# Altium project LimeSDR-Micro_M.2_1v0.PrjPcb (part 4 of 10)

## Sheet 07_LMS7002M_Power.SchDoc: LMS7002M power
size A3; Organization: Lime Microsystems; Address1: Surrey Tech Centre; Address2: Guildford GU2 7YG; Address3: Surrey; Address4: United Kingdom; Revision: v1.0; SheetNumber: 7; SheetTotal: 11
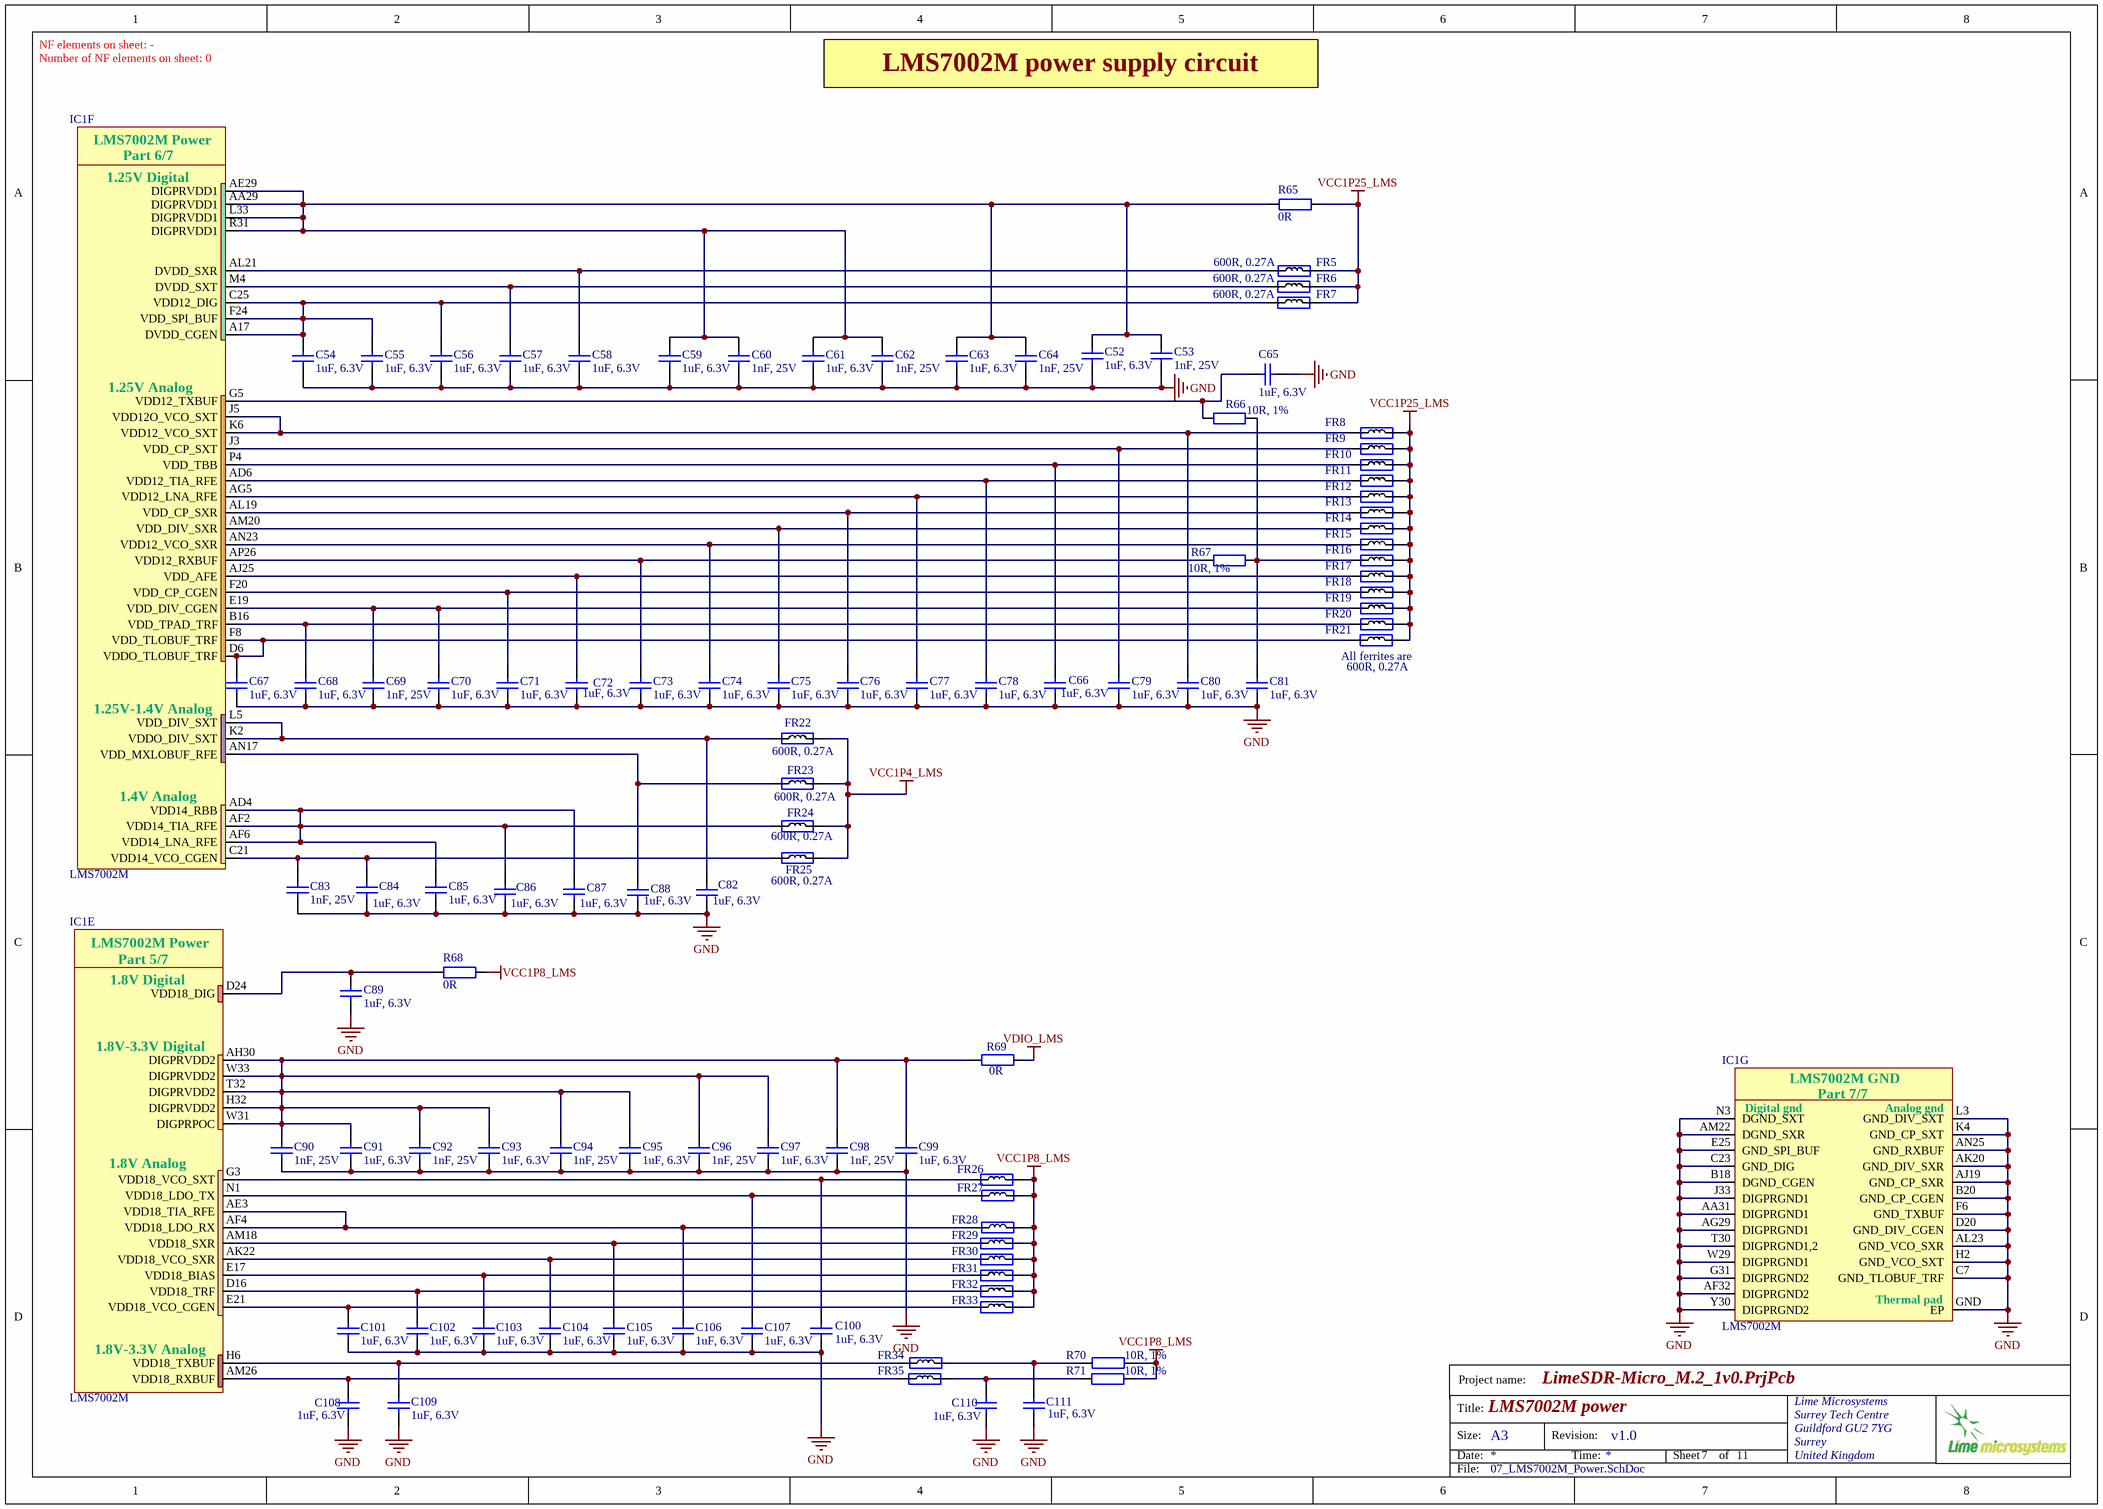
[diagram p6: 07_LMS7002M_Power.SchDoc]

### Parts
(Parts that share a designator on the sheet are numbered #1, #2 ... from top to bottom, then left to right.)
C52  1uF, 6.3V  [CAP0201]
C53  1nF, 25V  [CAP0201]
C54  1uF, 6.3V  [CAP0201]
C55  1uF, 6.3V  [CAP0201]
C56  1uF, 6.3V  [CAP0201]
C57  1uF, 6.3V  [CAP0201]
C58  1uF, 6.3V  [CAP0201]
C59  1uF, 6.3V  [CAP0201]
C60  1nF, 25V  [CAP0201]
C61  1uF, 6.3V  [CAP0201]
C62  1nF, 25V  [CAP0201]
C63  1uF, 6.3V  [CAP0201]
C64  1nF, 25V  [CAP0201]
C65  1uF, 6.3V  [CAP0201]
C66  1uF, 6.3V  [CAP0201]
C67  1uF, 6.3V  [CAP0201]
C68  1uF, 6.3V  [CAP0201]
C69  1nF, 25V  [CAP0201]
C70  1uF, 6.3V  [CAP0201]
C71  1uF, 6.3V  [CAP0201]
C72  1uF, 6.3V  [CAP0201]
C73  1uF, 6.3V  [CAP0201]
C74  1uF, 6.3V  [CAP0201]
C75  1uF, 6.3V  [CAP0201]
C76  1uF, 6.3V  [CAP0201]
C77  1uF, 6.3V  [CAP0201]
C78  1uF, 6.3V  [CAP0201]
C79  1uF, 6.3V  [CAP0201]
C80  1uF, 6.3V  [CAP0201]
C81  1uF, 6.3V  [CAP0201]
C82  1uF, 6.3V  [CAP0201]
C83  1nF, 25V  [CAP0201]
C84  1uF, 6.3V  [CAP0201]
C85  1uF, 6.3V  [CAP0201]
C86  1uF, 6.3V  [CAP0201]
C87  1uF, 6.3V  [CAP0201]
C88  1uF, 6.3V  [CAP0201]
C89  1uF, 6.3V  [CAP0201]
C90  1nF, 25V  [CAP0201]
C91  1uF, 6.3V  [CAP0201]
C92  1nF, 25V  [CAP0201]
C93  1uF, 6.3V  [CAP0201]
C94  1nF, 25V  [CAP0201]
C95  1uF, 6.3V  [CAP0201]
C96  1nF, 25V  [CAP0201]
C97  1uF, 6.3V  [CAP0201]
C98  1nF, 25V  [CAP0201]
C99  1uF, 6.3V  [CAP0201]
C100  1uF, 6.3V  [CAP0201]
C101  1uF, 6.3V  [CAP0201]
C102  1uF, 6.3V  [CAP0201]
C103  1uF, 6.3V  [CAP0201]
C104  1uF, 6.3V  [CAP0201]
C105  1uF, 6.3V  [CAP0201]
C106  1uF, 6.3V  [CAP0201]
C107  1uF, 6.3V  [CAP0201]
C108  1uF, 6.3V  [CAP0201]
C109  1uF, 6.3V  [CAP0201]
C110  1uF, 6.3V  [CAP0201]
C111  1uF, 6.3V  [CAP0201]
FR5#1  600R, 0.27A  [RES0201]
FR6#1  600R, 0.27A  [RES0201]
FR7  600R, 0.27A  [RES0201]
FR8  600R, 0.27A  [RES0201]
FR9  600R, 0.27A  [RES0201]  (value not drawn)
FR10  600R, 0.27A  [RES0201]  (value not drawn)
FR11  600R, 0.27A  [RES0201]  (value not drawn)
FR12  600R, 0.27A  [RES0201]  (value not drawn)
FR13  600R, 0.27A  [RES0201]  (value not drawn)
FR14  600R, 0.27A  [RES0201]  (value not drawn)
FR15  600R, 0.27A  [RES0201]  (value not drawn)
FR16  600R, 0.27A  [RES0201]  (value not drawn)
FR17  600R, 0.27A  [RES0201]  (value not drawn)
FR18  600R, 0.27A  [RES0201]  (value not drawn)
FR19  600R, 0.27A  [RES0201]  (value not drawn)
FR20  600R, 0.27A  [RES0201]  (value not drawn)
FR21  600R, 0.27A  [RES0201]  (value not drawn)
FR22  600R, 0.27A  [RES0201]
FR23  600R, 0.27A  [RES0201]
FR24  600R, 0.27A  [RES0201]
FR25  600R, 0.27A  [RES0201]
FR26  600R, 0.27A  [RES0201]  (value not drawn)
FR27  600R, 0.27A  [RES0201]  (value not drawn)
FR28  600R, 0.27A  [RES0201]  (value not drawn)
FR29  600R, 0.27A  [RES0201]  (value not drawn)
FR30  600R, 0.27A  [RES0201]  (value not drawn)
FR31  600R, 0.27A  [RES0201]  (value not drawn)
FR32  600R, 0.27A  [RES0201]  (value not drawn)
FR33  600R, 0.27A  [RES0201]  (value not drawn)
FR34  600R, 0.27A  [RES0201]  (value not drawn)
FR35  600R, 0.27A  [RES0201]  (value not drawn)
IC1  LMS7002M  [LMS7002M_v5_LESS_SILK]  (parts E,F,G of 7)
R65  0R  [RES0402]
R66  10R, 1%  [RES0201]
R67  10R, 1%  [RES0201]
R68  0R  [RES0201]
R69  0R  [RES0402]
R70  10R, 1%  [RES0201]
R71  10R, 1%  [RES0201]

### Nets
GND: C52.2 C53.2 C54.2 C55.2 C56.2 C57.1 C58.2 C59.2 C60.2 C61.2 C62.2 C63.2 C64.2 C65.2 C66.2 C67.2 C68.2 C69.2 C70.2 C71.1 C72.2 C73.2 C74.2 C75.2 C76.2 C77.2 C78.1 C79.2 C80.1 C81.1 C82.2 C83.2 C84.2 C85.2 C86.2 C87.2 C88.2 C89.2 C90.2 C91.2 C92.2 C93.2 C94.2 C95.2 C96.2 C97.2 C98.2 C99.2 C100.2 C101.2 C102.2 C103.2 C104.2 C105.2 C106.2 C107.2 C108.2 C109.2 C110.2 C111.2 IC1.AA31(DIGPRGND1) IC1.AF32(DIGPRGND2) IC1.AG29(DIGPRGND1) IC1.AJ19(GND_CP_SXR) IC1.AK20(GND_DIV_SXR) IC1.AL23(GND_VCO_SXR) IC1.AM22(DGND_SXR) IC1.AN25(GND_RXBUF) IC1.B18(DGND_CGEN) IC1.B20(GND_CP_CGEN) IC1.C7(GND_TLOBUF_TRF) IC1.C23(GND_DIG) IC1.D20(GND_DIV_CGEN) IC1.E25(GND_SPI_BUF) IC1.F6(GND_TXBUF) IC1.G31(DIGPRGND2) IC1.GND(EP) IC1.H2(GND_VCO_SXT) IC1.J33(DIGPRGND1) IC1.K4(GND_CP_SXT) IC1.L3(GND_DIV_SXT) IC1.N3(DGND_SXT) IC1.T30(DIGPRGND1,2) IC1.W29(DIGPRGND1) IC1.Y30(DIGPRGND2)
VCC1P4_LMS: FR22.2 FR23.2 FR24.2 FR25.2
VCC1P8_LMS: FR26.2 FR27.1 FR28.1 FR29.2 FR30.2 FR31.2 FR32.2 FR33.2 R68.2 R70.2 R71.1
VCC1P25_LMS: FR5#1.2 FR6#1.2 FR7.2 FR8.2 FR9.2 FR10.2 FR11.2 FR12.2 FR13.2 FR14.2 FR15.2 FR16.2 FR17.2 FR18.2 FR19.2 FR20.2 FR21.2 R65.1
VDIO_LMS: R69.1
NetC52_1: C52.1 C53.1 C59.1 C60.1 C61.1 C62.1 C63.1 C64.1 IC1.AA29(DIGPRVDD1) IC1.AE29(DIGPRVDD1) IC1.L33(DIGPRVDD1) IC1.R31(DIGPRVDD1) R65.2
NetC54_1: C54.1 C55.1 C56.1 FR7.1 IC1.A17(DVDD_CGEN) IC1.C25(VDD12_DIG) IC1.F24(VDD_SPI_BUF)
NetC57_2: C57.2 FR6#1.1 IC1.M4(DVDD_SXT)
NetC58_1: C58.1 FR5#1.1 IC1.AL21(DVDD_SXR)
NetC65_1: C65.1 IC1.G5(VDD12_TXBUF) R66.1
NetC66_1: C66.1 FR10.1 IC1.P4(VDD_TBB)
NetC67_1: C67.1 FR21.1 IC1.D6(VDDO_TLOBUF_TRF) IC1.F8(VDD_TLOBUF_TRF)
NetC68_1: C68.1 FR20.1 IC1.B16(VDD_TPAD_TRF)
NetC69_1: C69.1 C70.1 FR19.1 IC1.E19(VDD_DIV_CGEN)
NetC71_2: C71.2 FR18.1 IC1.F20(VDD_CP_CGEN)
NetC72_1: C72.1 FR17.1 IC1.AJ25(VDD_AFE)
NetC73_1: C73.1 IC1.AP26(VDD12_RXBUF) R67.1
NetC74_1: C74.1 FR15.1 IC1.AN23(VDD12_VCO_SXR)
NetC75_1: C75.1 FR14.1 IC1.AM20(VDD_DIV_SXR)
NetC76_1: C76.1 FR13.1 IC1.AL19(VDD_CP_SXR)
NetC77_1: C77.1 FR12.1 IC1.AG5(VDD12_LNA_RFE)
NetC78_2: C78.2 FR11.1 IC1.AD6(VDD12_TIA_RFE)
NetC79_1: C79.1 FR9.1 IC1.J3(VDD_CP_SXT)
NetC80_2: C80.2 FR8.1 IC1.J5(VDD12O_VCO_SXT) IC1.K6(VDD12_VCO_SXT)
NetC81_2: C81.2 FR16.1 R66.2 R67.2
NetC82_1: C82.1 FR22.1 IC1.K2(VDDO_DIV_SXT) IC1.L5(VDD_DIV_SXT)
NetC83_1: C83.1 C84.1 FR25.1 IC1.C21(VDD14_VCO_CGEN)
NetC85_1: C85.1 C86.1 C87.1 FR24.1 IC1.AD4(VDD14_RBB) IC1.AF2(VDD14_TIA_RFE) IC1.AF6(VDD14_LNA_RFE)
NetC88_1: C88.1 FR23.1 IC1.AN17(VDD_MXLOBUF_RFE)
NetC89_1: C89.1 IC1.D24(VDD18_DIG) R68.1
NetC90_1: C90.1 C91.1 C92.1 C93.1 C94.1 C95.1 C96.1 C97.1 C98.1 C99.1 IC1.AH30(DIGPRVDD2) IC1.H32(DIGPRVDD2) IC1.T32(DIGPRVDD2) IC1.W31(DIGPRPOC) IC1.W33(DIGPRVDD2) R69.2
NetC100_1: C100.1 FR26.1 IC1.G3(VDD18_VCO_SXT)
NetC101_1: C101.1 FR33.1 IC1.E21(VDD18_VCO_CGEN)
NetC102_1: C102.1 FR32.1 IC1.D16(VDD18_TRF)
NetC103_1: C103.1 FR31.1 IC1.E17(VDD18_BIAS)
NetC104_1: C104.1 FR30.1 IC1.AK22(VDD18_VCO_SXR)
NetC105_1: C105.1 FR29.1 IC1.AM18(VDD18_SXR)
NetC106_1: C106.1 FR28.2 IC1.AE3(VDD18_TIA_RFE) IC1.AF4(VDD18_LDO_RX)
NetC107_1: C107.1 FR27.2 IC1.N1(VDD18_LDO_TX)
NetC108_1: C108.1 FR35.1 IC1.AM26(VDD18_RXBUF)
NetC109_1: C109.1 FR34.2 IC1.H6(VDD18_TXBUF)
NetC110_1: C110.1 FR35.2 R71.2
NetC111_1: C111.1 FR34.1 R70.1

### Notes on the sheet
- NF elements on sheet: -
- Number of NF elements on sheet: 0
- LMS7002M power supply circuit
- (near FR21) All ferrites are
- Project name:
- Title:
- Size:
- Date:
- A3
- Revision:
- Time:
- Sheet
- of
- File:
- (in symbol LMS7002Mr4, part E) LMS7002M Power; Part 5/7; 1.8V Digital; 1.8V-3.3V Digital; 1.8V Analog; 1.8V-3.3V Analog
- (in symbol LMS7002Mr4, part F) LMS7002M Power; Part 6/7; 1.25V Digital; 1.25V Analog; 1.25V-1.4V Analog; 1.4V Analog
- (in symbol LMS7002Mr4, part G) LMS7002M GND; Part 7/7; Digital gnd; Analog gnd; Thermal pad

### Library data of the parts
C52 C54-C59 C61 C63 C65-C68 C70-C82 C84-C89 C91 C93 C95 C97 C99-C111 = Cap_0402: Manufacturer: TDK Corporation; Manufacturer Part Number 1: JMK063ABJ105MP-F; Part Description: 1µF ±20% 6.3V X5R Ceramic Capacitor -55°C ~ 85°C Surface Mount, MLCC 0201 (0603 Metric) 0.024" L x 0.012" W (0.60mm x 0.30mm); Value: 1uF, 20%; Tolerance: ±20%; Capacitance: 1.0µF; Temperature Coefficient: X5R; Supplier 1: Digi-Key; Supplier Part Number 1: 587-5864-2-ND; Applications: General Purpose; Features: -; Lead Style: -; Ratings: -; Thickness (Max): -; Lead Spacing: -; Height - Seated (Max): -; Size / Dimension: 0.024" L x 0.012" W (0.60mm x 0.30mm); Mounting Type: Surface Mount, MLCC; Operating Temperature: -55°C ~ 85°C; Package / Case: 0201 (0603 Metric); Packaging: Cut Tape (CT); Voltage - Rated: 6.3V; Category: Capacitors; RoHS: RoHS Compliant
C53 C60 C62 C64 C69 C83 C90 C92 C94 C96 C98 = Cap_0402: Manufacturer Part Number 1: C0603X7R1E102K030BA; Manufacturer: TDK Corporation; Part Description: 1000pF ±10% 25V X7R Ceramic Capacitor -55°C ~ 125°C Surface Mount, MLCC 0201 (0603 Metric) 0.024" L x 0.012" W (0.60mm x 0.30mm); Temperature Coefficient: X7R; Tolerance: ±10%; Capacitance: 1000pF; Value: 1nF, 25V; Supplier 1: Digi-Key; Supplier Part Number 1: 445-7275-1-ND; Voltage - Rated: 25V; Features: -; Package / Case: 0201 (0603 Metric); Lead Spacing: -; Mounting Type: Surface Mount, MLCC; Lead Style: -; Height - Seated (Max): -; Operating Temperature: -55°C ~ 125°C; Size / Dimension: 0.024" L x 0.012" W (0.60mm x 0.30mm); Applications: General Purpose; Ratings: -; Thickness (Max): 0.013" (0.33mm); RoHS: RoHS Compliant; Packaging: Cut Tape (CT); Category: Capacitors
FR5#1 FR6#1 FR7-FR35 = Ferrite: Manufacturer Part Number 1: BK0603TS601-T; Manufacturer: Taiyo Yuden; Part Description: FERRITE BEAD 600 OHM 0201 1LN; DC Resistance (DCR): 750 mOhm Max; Filter Type: Differential Mode - Single; Impedance @ Frequency: 600 Ohm @ 100MHz; Current Rating: 270mA; Value: 600R@100MHz; Supplier 1: Digi-Key; Supplier Part Number 1: 587-3277-1-ND; Size / Dimension: 0.024" L x 0.012" W (0.60mm x 0.30mm); Package / Case: 0201 (0603 Metric); Height (Max): 0.013" (0.33mm); Mounting Type: Surface Mount; Packaging: Cut Tape (CT); RoHS: RoHS Compliant; Category: Filters
IC1 = LMS7002Mr4: Schematic symbol revision 4. Default footprint - 0.31mm pad; Manufacturer: Lime Microsystems; Part Description: IC FPRF Transceiver LMS7002M; 261 pin aQFN; Supplier 1: Lime Microsystems; Supplier Part Number 1: LMS7002M; Manufacturer Part Number 1: LMS7002M
R65 R69 = Res_0402: Manufacturer Part Number 1: RC0402JR-070RL; Manufacturer: Yageo; Part Description: RES SMD 0.0OHM JUMPER 1/16W 0402; Resistance (Ohms): 0.0; Tolerance: Jumper; Power (Watts): 0.063W, 1/16W; Value: 0R; Supplier 1: Digi-Key; Supplier Part Number 1: 311-0.0JRTR-ND; Category: Resistors; Temperature Coefficient: -; Features: Moisture Resistant; Supplier Device Package: 0402; Height: 0.016" (0.40mm); Package / Case: 0402 (1005 Metric); Operating Temperature: -55°C ~ 155°C; Size / Dimension: 0.039" L x 0.020" W (1.00mm x 0.50mm); Composition: Thick Film; Packaging: Tape & Reel (TR); Number of Terminations: 2; RoHS: RoHS Compliant
R66 R67 R70 R71 = Res_0402: Manufacturer: Panasonic Electronic Components; Part Description: RES SMD 10 OHM 1% 1/20W 0201; Manufacturer Part Number 1: ERJ-1GEF10R0C; Power (Watts): 0.05W, 1/20W; Resistance (Ohms): 10; Temperature Coefficient: ±200ppm/°C; Value: 10R, 1%; Supplier 1: Digi-Key; Supplier Part Number 1: P10.0ABCT-ND; Package / Case: 0201 (0603 Metric); Height: 0.010" (0.26mm); Supplier Device Package: 0201; Packaging: Cut Tape (CT); Composition: Thick Film; Category: Resistors; Tolerance: ±1%; Number of Terminations: 2; Size / Dimension: 0.024" L x 0.012" W (0.60mm x 0.30mm); Operating Temperature: -55°C ~ 125°C; Features: -; RoHS: RoHS Compliant
R68 = Res_0402: Manufacturer: Yageo; Part Description: 0 Ohms Jumper Chip Resistor 0201 (0603 Metric) Moisture Resistant Thick Film; Manufacturer Part Number 1: RC0201JR-070RL; Tolerance: 5%; Max Power Dissipation: 50mW; Voltage Rating (DC): 25V; Value: 0R; Supplier 1: Digi-Key; Supplier Part Number 1: 311-0.0NCT-ND; Number of Terminations: 2; Height: 0.01inch; Features: Moisture Resistant; RoHS: Yes; Packaging: Tape and Reel; Case/Package: 0201; Case Code (Imperial): 0201; Case Code (Metric): 0603; ComponentLink1Description: http://www.yageo.com/documents/recent/PYu-RC_Group_51_RoHS_L_7.pdf; ComponentLink1URL: http://www.yageo.com/documents/recent/PYu-RC_Group_51_RoHS_L_7.pdf; ComponentLink2Description: https://datasheet.ciiva.com/7672/1563626-7672248.pdf?src-supplier=Element14; ComponentLink2URL: https://datasheet.ciiva.com/7672/1563626-7672248.pdf?src-supplier=Element14; ComponentLink3Description: https://datasheet.ciiva.com/7672/1563626-7672247.pdf?src-supplier=Element14; ComponentLink3URL: https://datasheet.ciiva.com/7672/1563626-7672247.pdf?src-supplier=Element14; ComponentLink4Description: https://datasheet.ciiva.com/7660/1421516-7660808.pdf?src-supplier=Element14; ComponentLink4URL: https://datasheet.ciiva.com/7660/1421516-7660808.pdf?src-supplier=Element14; ComponentLink5Description: https://datasheet.ciiva.com/46391/1421516-46391340.pdf?src-supplier=Element14; ComponentLink5URL: https://datasheet.ciiva.com/46391/1421516-46391340.pdf?src-supplier=Element14; Construction: Rectangular; Contact Plating: Tin,Matte; Depth: 0.3mm; Lead Free: Lead Free; Length: 0.024inch; Max Operating Temperature: 125°C; Military Standard: Not; Min Operating Temperature: -55°C; Package Quantity: 1; Power Rating: 50mW; Pricing 1: 1=0,10000, 10=0,03700, 25=0,02680, 50=0,02020, 100=0,01500, 250=0,01140, 500=0,00912, 1000=0,00672, 5000=0,00482 (USD); Radiation Hardening: No; Resistance: 0R; Resistance Tolerance: 5%; Resistor Type: Thick Film; RoHS Compliant: Yes; Series: RC; Size Code: 0201; Stock 1: 6252381; Termination: SMD/SMT; Voltage Rating: 25V; Weight: 6E-06oz; Width: 0.012inch

## Sheet 08_BB_Processor.SchDoc: BB Processor
size A3; Organization: Lime Microsystems; Address1: Surrey Tech Centre; Address2: Guildford GU2 7YG; Address3: Surrey; Address4: United Kingdom; Revision: v1.0; SheetNumber: 8; SheetTotal: 11
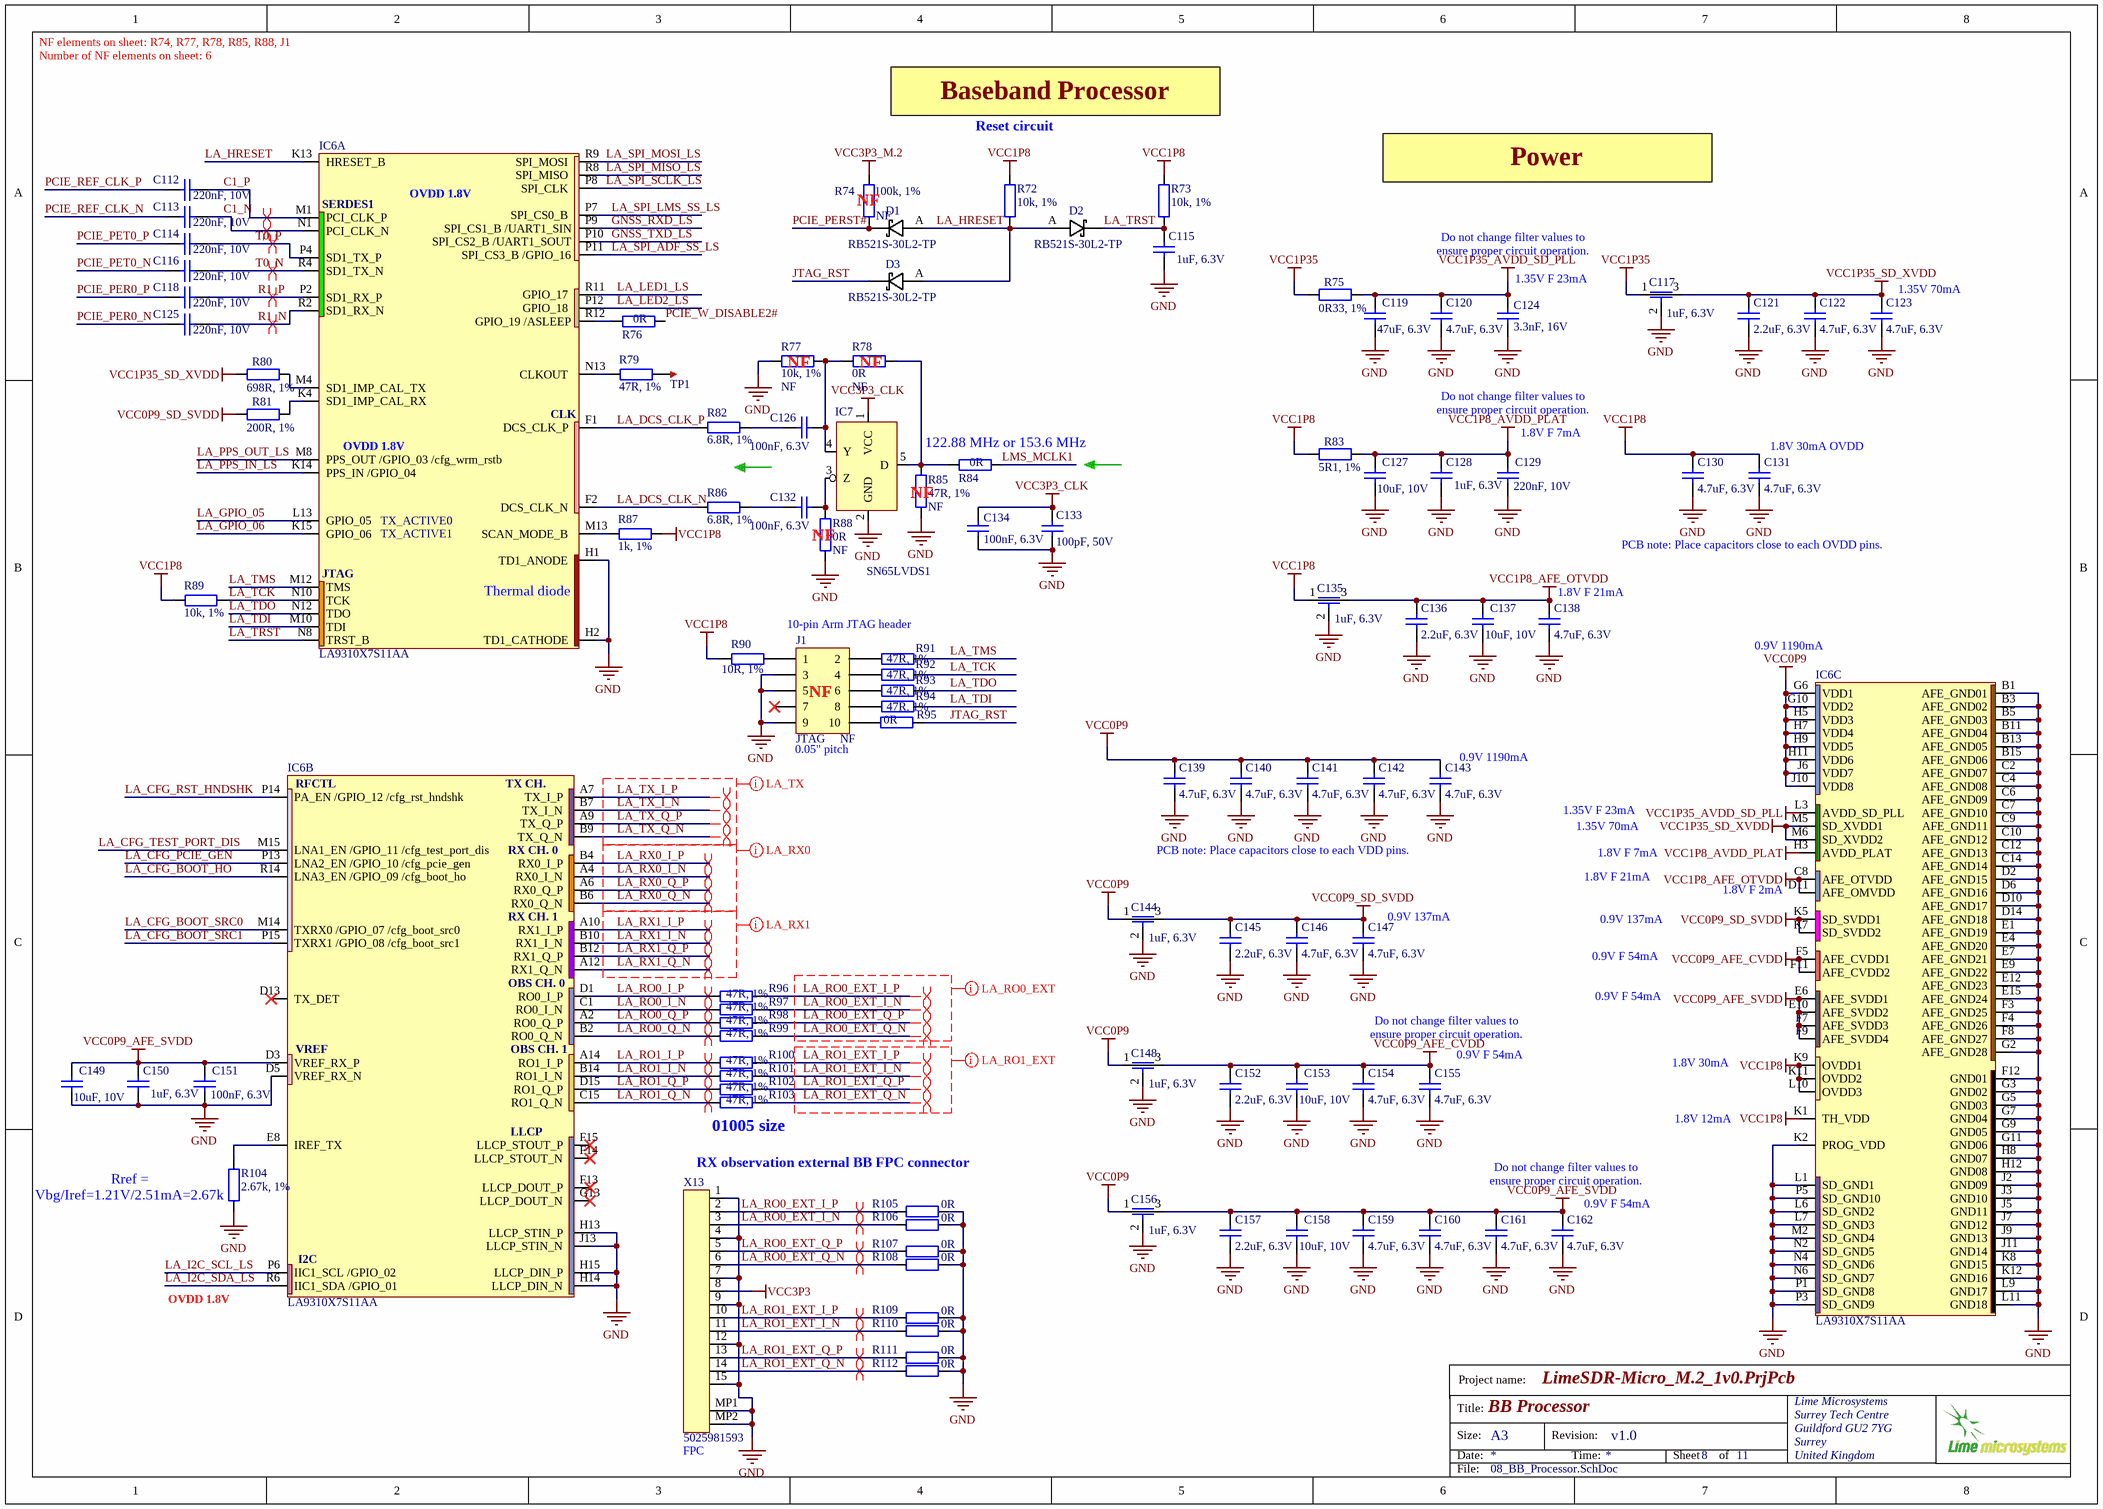
[diagram p7: 08_BB_Processor.SchDoc]

### Parts
(Parts that share a designator on the sheet are numbered #1, #2 ... from top to bottom, then left to right.)
C112#1  220nF, 10V  [CAP0201]
C113#1  220nF, 10V  [CAP0201]
C114#1  220nF, 10V  [CAP0201]
C115  1uF, 6.3V  [CAP0201]
C116  220nF, 10V  [CAP0201]
C117#1  1uF, 6.3V  [CAP0603_FEEDTHROUGH]
C118#1  220nF, 10V  [CAP0201]
C119#1  47uF, 6.3V  [CAP0603]
C120#1  4.7uF, 6.3V  [CAP0201]
C121  2.2uF, 6.3V  [CAP0201]
C122  4.7uF, 6.3V  [CAP0201]
C123  4.7uF, 6.3V  [CAP0201]
C124#1  3.3nF, 16V  [CAP0201]
C125#1  220nF, 10V  [CAP0201]
C126#1  100nF, 6.3V  [CAP0201]
C127#1  10uF, 10V  [CAP0402]
C128  1uF, 6.3V  [CAP0201]
C129  220nF, 10V  [CAP0201]
C130  4.7uF, 6.3V  [CAP0201]
C131  4.7uF, 6.3V  [CAP0201]
C132  100nF, 6.3V  [CAP0201]
C133  100pF, 50V  [CAP0201]
C134  100nF, 6.3V  [CAP0201]
C135  1uF, 6.3V  [CAP0603_FEEDTHROUGH]
C136  2.2uF, 6.3V  [CAP0201]
C137  10uF, 10V  [CAP0402]
C138  4.7uF, 6.3V  [CAP0201]
C139  4.7uF, 6.3V  [CAP0201]
C140  4.7uF, 6.3V  [CAP0201]
C141  4.7uF, 6.3V  [CAP0201]
C142  4.7uF, 6.3V  [CAP0201]
C143  4.7uF, 6.3V  [CAP0201]
C144  1uF, 6.3V  [CAP0603_FEEDTHROUGH]
C145  2.2uF, 6.3V  [CAP0201]
C146  4.7uF, 6.3V  [CAP0201]
C147  4.7uF, 6.3V  [CAP0201]
C148  1uF, 6.3V  [CAP0603_FEEDTHROUGH]
C149  10uF, 10V  [CAP0402]
C150  1uF, 6.3V  [CAP0201]
C151  100nF, 6.3V  [CAP0201]
C152  2.2uF, 6.3V  [CAP0201]
C153  10uF, 10V  [CAP0402]
C154  4.7uF, 6.3V  [CAP0201]
C155  4.7uF, 6.3V  [CAP0201]
C156  1uF, 6.3V  [CAP0603_FEEDTHROUGH]
C157  2.2uF, 6.3V  [CAP0201]
C158  10uF, 10V  [CAP0402]
C159  4.7uF, 6.3V  [CAP0201]
C160  4.7uF, 6.3V  [CAP0201]
C161  4.7uF, 6.3V  [CAP0201]
C162  4.7uF, 6.3V  [CAP0201]
D1  RB521S-30L2-TP  [RB521S-30L2-TP_DFN1006]
D2  RB521S-30L2-TP  [RB521S-30L2-TP_DFN1006]
D3  RB521S-30L2-TP  [RB521S-30L2-TP_DFN1006]
IC6  LA9310X7S11AA  [LA9310X7S11AA]  (parts A,B,C of 3)
IC7  SN65LVDS1  [SOT23-5_NO_SILK]
J1  JTAG  Assembly Info: NF  [HEADER_5x2_TH_HALF_PITCH]
R72  10k, 1%  [RES0201]
R73  10k, 1%  [RES0201]
R74  100k, 1%  Assembly Info: NF  [RES0201]
R75  0R33, 1%  [RES0201]
R76  0R  [RES0201]
R77  10k, 1%  Assembly Info: NF  [RES0201]
R78  0R  Assembly Info: NF  [RES0201]
R79  47R, 1%  [RES0201]
R80  698R, 1%  [RES0201]
R81  200R, 1%  [RES0201]
R82  6.8R, 1%  [RES0201]
R83  5R1, 1%  [RES0201]
R84  0R  [RES0201]
R85  47R, 1%  Assembly Info: NF  [RES0201]
R86  6.8R, 1%  [RES0201]
R87  1k, 1%  [RES0201]
R88  0R  Assembly Info: NF  [RES0201]
R89  10k, 1%  [RES0201]
R90  10R, 1%  [RES0201]
R91  47R, 1%  [RES0201]
R92  47R, 1%  [RES0201]
R93  47R, 1%  [RES0201]
R94  47R, 1%  [RES0201]
R95  0R  [RES0201]
R96  47R, 1%  [RES01005]
R97  47R, 1%  [RES01005]
R98  47R, 1%  [RES01005]
R99  47R, 1%  [RES01005]
R100  47R, 1%  [RES01005]
R101  47R, 1%  [RES01005]
R102  47R, 1%  [RES01005]
R103  47R, 1%  [RES01005]
R104  2.67k, 1%  [RES0201]
R105  0R  [RES01005]
R106  0R  [RES01005]
R107  0R  [RES01005]
R108  0R  [RES01005]
R109  0R  [RES01005]
R110  0R  [RES01005]
R111  0R  [RES01005]
R112  0R  [RES01005]
TP1  TESTPOINT_PAD  [TP_PAD_1MM]  (value not drawn)  (no BOM)
X13  5025981593  [5025981593_FPC_connector]

### Nets
GND: C115.2 C117#1.2 C119#1.1 C120#1.1 C121.1 C122.1 C123.1 C124#1.2 C127#1.1 C128.2 C129.2 C130.1 C131.1 C133.1 C134.2 C135.2 C136.1 C137.1 C138.1 C139.1 C140.1 C141.1 C142.1 C143.1 C144.2 C145.1 C146.1 C147.1 C148.2 C149.1 C150.2 C151.2 C152.1 C153.1 C154.1 C155.1 C156.2 C157.1 C158.1 C159.1 C160.1 C161.1 C162.1 IC6.B1(AFE_GND01) IC6.B3(AFE_GND02) IC6.B5(AFE_GND03) IC6.B11(AFE_GND04) IC6.B13(AFE_GND05) IC6.B15(AFE_GND06) IC6.C2(AFE_GND07) IC6.C4(AFE_GND08) IC6.C6(AFE_GND09) IC6.C7(AFE_GND10) IC6.C9(AFE_GND11) IC6.C10(AFE_GND12) IC6.C12(AFE_GND13) IC6.C14(AFE_GND14) IC6.D2(AFE_GND15) IC6.D5(VREF_RX_N) IC6.D6(AFE_GND16) IC6.D10(AFE_GND17) IC6.D14(AFE_GND18) IC6.E1(AFE_GND19) IC6.E4(AFE_GND20) IC6.E7(AFE_GND21) IC6.E9(AFE_GND22) IC6.E12(AFE_GND23) IC6.E15(AFE_GND24) IC6.F3(AFE_GND25) IC6.F4(AFE_GND26) IC6.F8(AFE_GND27) IC6.F12(GND01) IC6.G2(AFE_GND28) IC6.G3(GND02) IC6.G5(GND03) IC6.G7(GND04) IC6.G9(GND05) IC6.G11(GND06) IC6.H1(TD1_ANODE) IC6.H2(TD1_CATHODE) IC6.H8(GND07) IC6.H12(GND08) IC6.H13(LLCP_STIN_P) IC6.H14(LLCP_DIN_N) IC6.H15(LLCP_DIN_P) IC6.J2(GND09) IC6.J3(GND10) IC6.J5(GND11) IC6.J7(GND12) IC6.J9(GND13) IC6.J11(GND14) IC6.J13(LLCP_STIN_N) IC6.K2(PROG_VDD) IC6.K8(GND15) IC6.K12(GND16) IC6.L1(SD_GND1) IC6.L6(SD_GND2) IC6.L7(SD_GND3) IC6.L9(GND17) IC6.L11(GND18) IC6.M2(SD_GND4) IC6.N2(SD_GND5) IC6.N4(SD_GND6) IC6.N6(SD_GND7) IC6.P1(SD_GND8) IC6.P3(SD_GND9) IC6.P5(SD_GND10) IC7.2(GND) J1.3 J1.5 J1.9 R77.1 R85.2 R88.1 R104.2 R105.2 R106.2 R107.2 R108.2 R109.2 R110.2 R111.2 R112.2 X13.1 X13.4 X13.7 X13.9 X13.12 X13.15 X13.MP1 X13.MP2
VCC0P9: C139.2 C140.2 C141.2 C142.2 C143.2 C144.1 C148.1 C156.1 IC6.G6(VDD1) IC6.G10(VDD2) IC6.H5(VDD3) IC6.H7(VDD4) IC6.H9(VDD5) IC6.H11(VDD6) IC6.J6(VDD7) IC6.J10(VDD8)
VCC0P9_AFE_CVDD: C148.3 C152.2 C153.2 C154.2 C155.2 IC6.F5(AFE_CVDD1) IC6.F11(AFE_CVDD2)
VCC0P9_AFE_SVDD: C149.2 C150.1 C151.1 C156.3 C157.2 C158.2 C159.2 C160.2 C161.2 C162.2 IC6.D3(VREF_RX_P) IC6.E6(AFE_SVDD1) IC6.E10(AFE_SVDD2) IC6.F7(AFE_SVDD3) IC6.F9(AFE_SVDD4)
VCC0P9_SD_SVDD: C144.3 C145.2 C146.2 C147.2 IC6.K5(SD_SVDD1) IC6.K7(SD_SVDD2) R81.2
VCC1P8: C130.2 C131.2 C135.1 IC6.K1(TH_VDD) IC6.K9(OVDD1) IC6.K11(OVDD2) IC6.L10(OVDD3) R72.1 R73.1 R83.2 R87.2 R89.1 R90.2
VCC1P8_AFE_OTVDD: C135.3 C136.2 C137.2 C138.2 IC6.C8(AFE_OTVDD) IC6.D11(AFE_OMVDD)
VCC1P8_AVDD_PLAT: C127#1.2 C128.1 C129.1 IC6.H3(AVDD_PLAT) R83.1
VCC1P35: C117#1.1 R75.2
VCC1P35_AVDD_SD_PLL: C119#1.2 C120#1.2 C124#1.1 IC6.L3(AVDD_SD_PLL) R75.1
VCC1P35_SD_XVDD: C117#1.3 C121.2 C122.2 C123.2 IC6.M5(SD_XVDD1) IC6.M6(SD_XVDD2) R80.2
VCC3P3: X13.8
VCC3P3_CLK: C133.2 C134.1 IC7.1(VCC)
VCC3P3_M.2: R74.1
C1_N: C113#1.2 IC6.N1(PCI_CLK_N)
C1_P: C112#1.2 IC6.M1(PCI_CLK_P)
GNSS_RXD_LS: IC6.P9(SPI_CS1_B_/UART1_SIN)
GNSS_TXD_LS: IC6.P10(SPI_CS2_B_/UART1_SOUT)
JTAG_RST: D3.C R95.2
LA_CFG_BOOT_HO: IC6.R14(LNA3_EN_/GPIO_09_/cfg_boot_ho)
LA_CFG_BOOT_SRC0: IC6.M14(TXRX0_/GPIO_07_/cfg_boot_src0)
LA_CFG_BOOT_SRC1: IC6.P15(TXRX1_/GPIO_08_/cfg_boot_src1)
LA_CFG_PCIE_GEN: IC6.P13(LNA2_EN_/GPIO_10_/cfg_pcie_gen)
LA_CFG_RST_HNDSHK: IC6.P14(PA_EN_/GPIO_12_/cfg_rst_hndshk)
LA_CFG_TEST_PORT_DIS: IC6.M15(LNA1_EN_/GPIO_11_/cfg_test_port_dis)
LA_DCS_CLK_N: IC6.F2(DCS_CLK_N) R86.2
LA_DCS_CLK_P: IC6.F1(DCS_CLK_P) R82.2
LA_GPIO_05: IC6.L13(GPIO_05)
LA_GPIO_06: IC6.K15(GPIO_06)
LA_HRESET: D1.A D2.A D3.A IC6.K13(HRESET_B) R72.2
LA_I2C_SCL_LS: IC6.P6(IIC1_SCL_/GPIO_02)
LA_I2C_SDA_LS: IC6.R6(IIC1_SDA_/GPIO_01)
LA_LED1_LS: IC6.R11(GPIO_17)
LA_LED2_LS: IC6.P12(GPIO_18)
LA_PPS_IN_LS: IC6.K14(PPS_IN_/GPIO_04)
LA_PPS_OUT_LS: IC6.M8(PPS_OUT_/GPIO_03_/cfg_wrm_rstb)
LA_RO0_EXT_I_N: R97.2 R106.1 X13.3
LA_RO0_EXT_I_P: R96.2 R105.1 X13.2
LA_RO0_EXT_Q_N: R99.2 R108.1 X13.6
LA_RO0_EXT_Q_P: R98.2 R107.1 X13.5
LA_RO0_I_N: IC6.C1(RO0_I_N) R97.1
LA_RO0_I_P: IC6.D1(RO0_I_P) R96.1
LA_RO0_Q_N: IC6.B2(RO0_Q_N) R99.1
LA_RO0_Q_P: IC6.A2(RO0_Q_P) R98.1
LA_RO1_EXT_I_N: R101.2 R110.1 X13.11
LA_RO1_EXT_I_P: R100.2 R109.1 X13.10
LA_RO1_EXT_Q_N: R103.2 R112.1 X13.14
LA_RO1_EXT_Q_P: R102.2 R111.1 X13.13
LA_RO1_I_N: IC6.B14(RO1_I_N) R101.1
LA_RO1_I_P: IC6.A14(RO1_I_P) R100.1
LA_RO1_Q_N: IC6.C15(RO1_Q_N) R103.1
LA_RO1_Q_P: IC6.D15(RO1_Q_P) R102.1
LA_RX0_I_N: IC6.A4(RX0_I_N)
LA_RX0_I_P: IC6.B4(RX0_I_P)
LA_RX0_Q_N: IC6.B6(RX0_Q_N)
LA_RX0_Q_P: IC6.A6(RX0_Q_P)
LA_RX1_I_N: IC6.B10(RX1_I_N)
LA_RX1_I_P: IC6.A10(RX1_I_P)
LA_RX1_Q_N: IC6.A12(RX1_Q_N)
LA_RX1_Q_P: IC6.B12(RX1_Q_P)
LA_SPI_ADF_SS_LS: IC6.P11(SPI_CS3_B_/GPIO_16)
LA_SPI_LMS_SS_LS: IC6.P7(SPI_CS0_B)
LA_SPI_MISO_LS: IC6.R8(SPI_MISO)
LA_SPI_MOSI_LS: IC6.R9(SPI_MOSI)
LA_SPI_SCLK_LS: IC6.P8(SPI_CLK)
LA_TCK: IC6.N10(TCK) R89.2 R92.1
LA_TDI: IC6.M10(TDI) R94.1
LA_TDO: IC6.N12(TDO) R93.1
LA_TMS: IC6.M12(TMS) R91.1
LA_TRST: C115.1 D2.C IC6.N8(TRST_B) R73.2
LA_TX_I_N: IC6.B7(TX_I_N)
LA_TX_I_P: IC6.A7(TX_I_P)
LA_TX_Q_N: IC6.B9(TX_Q_N)
LA_TX_Q_P: IC6.A9(TX_Q_P)
LMS_MCLK1: R84.1
PCIE_PER0_N: C125#1.1
PCIE_PER0_P: C118#1.1
PCIE_PERST#: D1.C R74.2
PCIE_PET0_N: C116.1
PCIE_PET0_P: C114#1.1
PCIE_REF_CLK_N: C113#1.1
PCIE_REF_CLK_P: C112#1.1
PCIE_W_DISABLE2#: R76.1
R1_N: C125#1.2 IC6.R2(SD1_RX_N)
R1_P: C118#1.2 IC6.P2(SD1_RX_P)
T0_N: C116.2 IC6.R4(SD1_TX_N)
T0_P: C114#1.2 IC6.P4(SD1_TX_P)
NetC126#1_1: C126#1.1 R82.1
NetC126#1_2: C126#1.2 IC7.4(Y) R77.2 R78.2
NetC132_1: C132.1 R86.1
NetC132_2: C132.2 IC7.3(Z) R88.2
NetIC6_E8: IC6.E8(IREF_TX) R104.1
NetIC6_K4: IC6.K4(SD1_IMP_CAL_RX) R81.1
NetIC6_M4: IC6.M4(SD1_IMP_CAL_TX) R80.1
NetIC6_M13: IC6.M13(SCAN_MODE_B) R87.1
NetIC6_N13: IC6.N13(CLKOUT) R79.2
NetIC6_R12: IC6.R12(GPIO_19_/ASLEEP) R76.2
NetIC7_5: IC7.5(D) R78.1 R84.2 R85.1
NetJ1_1: J1.1 R90.1
NetJ1_2: J1.2 R91.2
NetJ1_4: J1.4 R92.2
NetJ1_6: J1.6 R93.2
NetJ1_8: J1.8 R94.2
NetJ1_10: J1.10 R95.1
NetR79_1: R79.1 TP1.1

Not connected (* = marked no-connect by the designer): IC6 D13(TX_DET_)* F13(LLCP_DOUT_P_)* F14(LLCP_STOUT_N_)* F15(LLCP_STOUT_P_)* G13(LLCP_DOUT_N_)*; J1 7*

### Layout directives
differential pair: C1_N, C1_P, LA_RO0_EXT_I_N, LA_RO0_EXT_I_P, LA_RO0_EXT_Q_N, LA_RO0_EXT_Q_P, LA_RO0_I_N, LA_RO0_I_P, LA_RO0_Q_N, LA_RO0_Q_P, LA_RO1_EXT_I_N, LA_RO1_EXT_I_P, LA_RO1_EXT_Q_N, LA_RO1_EXT_Q_P, LA_RO1_I_N, LA_RO1_I_P, LA_RO1_Q_N, LA_RO1_Q_P, LA_RX0_I_N, LA_RX0_I_P, LA_RX0_Q_N, LA_RX0_Q_P, LA_RX1_I_N, LA_RX1_I_P, LA_RX1_Q_N, LA_RX1_Q_P, LA_TX_I_N, LA_TX_I_P, LA_TX_Q_N, LA_TX_Q_P, R1_N, R1_P, T0_N, T0_P
net class LA_RX0: LA_RX0_I_N, LA_RX0_I_P, LA_RX0_Q_N, LA_RX0_Q_P
net class LA_RX1: LA_RX1_I_N, LA_RX1_I_P, LA_RX1_Q_N, LA_RX1_Q_P
net class LA_TX: LA_TX_I_N, LA_TX_I_P, LA_TX_Q_N, LA_TX_Q_P
net class LA_RO0_EXT: LA_RO0_EXT_I_N, LA_RO0_EXT_I_P, LA_RO0_EXT_Q_N, LA_RO0_EXT_Q_P
net class LA_RO1_EXT: LA_RO1_EXT_I_N, LA_RO1_EXT_I_P, LA_RO1_EXT_Q_N, LA_RO1_EXT_Q_P

### Notes on the sheet
- NF elements on sheet: R74, R77, R78, R85, R88, J1
- Number of NF elements on sheet: 6
- Baseband Processor
- (near R72) Reset circuit
- Power
- (near IC6) OVDD 1.8V
- (near R74) NF
- Do not change filter values to ensure proper circuit operation.
- (near C124#1) 1.35V F 23mA
- (near C123) 1.35V 70mA
- (near R77) NF
- (near R78) NF
- (near R84) 122.88 MHz or 153.6 MHz
- (near C129) 1.8V F 7mA
- (near C131) 1.8V 30mA OVDD
- NF
- (near R88) NF
- PCB note: Place capacitors close to each OVDD pins.
- (near IC6) Thermal diode
- 10-pin Arm JTAG header
- (near C138) 1.8V F 21mA
- (near IC6) 0.9V 1190mA
- (near J1) NF
- 0.05" pitch
- (near C143) 0.9V 1190mA
- PCB note: Place capacitors close to each VDD pins.
- 1.35V F 23mA
- 1.35V 70mA
- 1.8V F 7mA
- (near C147) 0.9V 137mA
- 1.8V F 21mA
- 0.9V 137mA
- (near IC6) 1.8V F 2mA
- 0.9V F 54mA
- (near C155) 0.9V F 54mA
- (near R103) 01005 size
- 1.8V 30mA
- 1.8V 12mA
- RX observation external BB FPC connector
- (near R104) Rref = Vbg/Iref=1.21V/2.51mA=2.67k
- (near C162) 0.9V F 54mA
- OVDD 1.8V
- (near X13) FPC
- Project name:
- Title:
- Size:
- Date:
- A3
- Revision:
- Time:
- Sheet
- of
- File:
- (in symbol LA9310X7S11AA, part A) SERDES1; CLK; TX_ACTIVE0; TX_ACTIVE1; JTAG
- (in symbol LA9310X7S11AA, part B) RFCTL; TX CH.; RX CH. 0; RX CH. 1; OBS CH. 0; VREF; OBS CH. 1; LLCP; I2C